# EAGLE schematic platiene1_v20 (EAGLE 9.7.0)
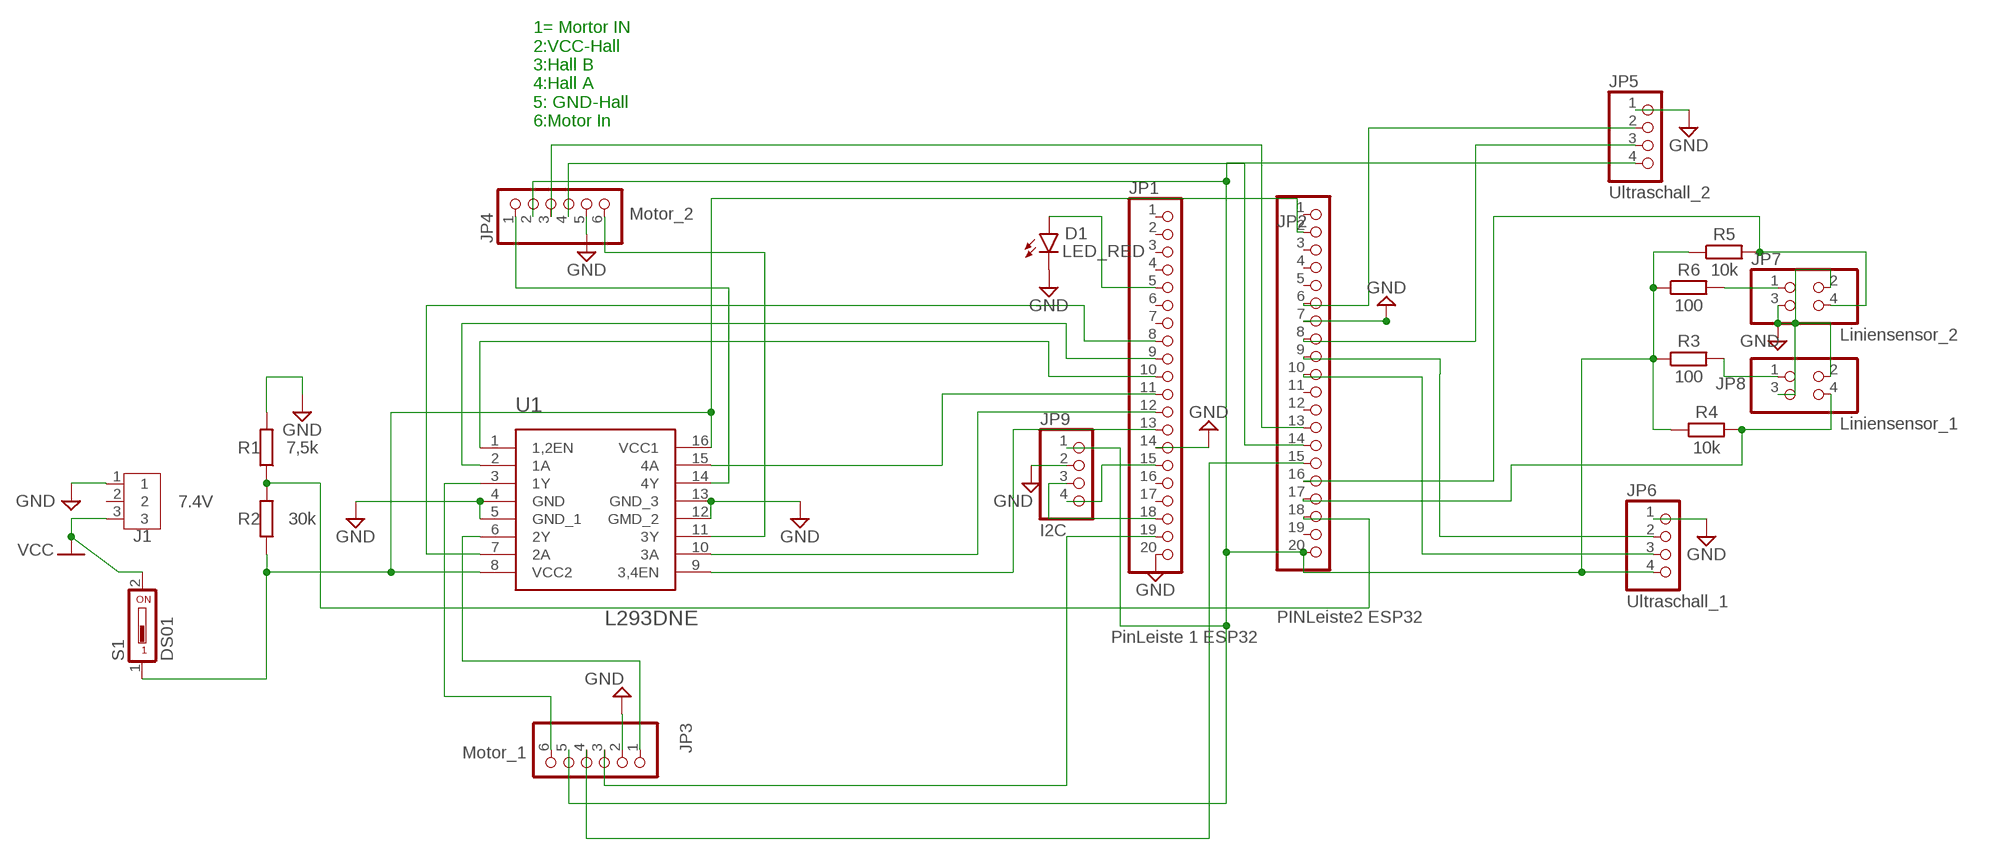
[diagram p0: schematic, sheet 1]

## Parts
D1  LED_RED  LED_RADIAL_RED  [LEDRD254W60D565H860B]
J1  7.4V  B3B-XH-A  [B3B-XH-A]
JP1  PinLeiste 1 ESP32  PINHD-1X20  [1X20]
JP2  PINLeiste2 ESP32  PINHD-1X20  [1X20]
JP3  Motor_1  PINHD-1X6  [1X06]
JP4  Motor_2  PINHD-1X6  [1X06]
JP5  Ultraschall_2  PINHD-1X4  [1X04]
JP6  Ultraschall_1  PINHD-1X4  [1X04]
JP7  Liniensensor_2  PINHD-2X2  [2X02]
JP8  Liniensensor_1  PINHD-2X2  [2X02]
JP9  I2C  PINHD-1X4  [1X04]
R1  7,5k  R_AXIAL-7.2MM-PITCH  [RESAD724W46L381D178B]
R2  30k  R_AXIAL-7.2MM-PITCH  [RESAD724W46L381D178B]
R3  100  R_AXIAL-7.2MM-PITCH  [RESAD724W46L381D178B]
R4  10k  R_AXIAL-7.2MM-PITCH  [RESAD724W46L381D178B]
R5  10k  R_AXIAL-7.2MM-PITCH  [RESAD724W46L381D178B]
R6  100  R_AXIAL-7.2MM-PITCH  [RESAD724W46L381D178B]
S1  DS01  [DS-01]
U1  L293DNE  [DIP-16_300MIL]

## Nets
GND: D1.2(C) J1.1 JP1.14 JP1.20 JP2.7 JP3.2 JP4.5 JP5.1 JP6.1 JP7.2 JP7.3 JP8.2 JP8.3 JP9.2 R1.2 U1.4(GND) U1.5(GND_1) U1.12(GMD_2) U1.13(GND_3)
N$1: JP1.11 U1.15(4A)
N$2: JP1.12 U1.10(3A)
N$3: JP1.13 U1.9(3,4EN)
N$4: JP1.10 U1.1(1,2EN)
N$5: JP1.8 U1.7(2A)
N$6: JP1.9 U1.2(1A)
N$7: JP2.2 R2.1 S1.1 U1.8(VCC2) U1.16(VCC1)
N$8: JP2.18 R1.1 R2.2
N$9: JP4.6 U1.11(3Y)
N$10: JP4.1 U1.14(4Y)
N$11: JP3.6 U1.3(1Y)
N$12: JP3.1 U1.6(2Y)
N$13: JP2.20 JP3.5 JP4.2 JP5.4 JP6.4 JP9.1 R3.1 R4.1 R5.1 R6.1
N$15: JP8.1 R3.2
N$16: JP2.6 JP5.2
N$17: JP7.1 R6.2
N$18: JP2.16 JP7.4 R5.2
N$19: JP2.17 JP8.4 R4.2
N$20: D1.1(A) JP1.5
N$21: JP2.8 JP5.3
N$22: JP2.9 JP6.2
N$23: JP2.13 JP4.3
N$24: JP2.10 JP6.3
N$27: JP2.14 JP4.4
N$28: JP2.15 JP3.4
N$29: JP1.19 JP3.3
N$30: JP1.18 JP9.3
N$31: JP1.15 JP9.4
VCC: J1.3 S1.2
Unconnected: J1.2 JP1.1 JP1.2 JP1.3 JP1.4 JP1.6 JP1.7 JP1.16 JP1.17 JP2.1 JP2.3 JP2.4 JP2.5 JP2.11 JP2.12 JP2.19

## Notes on the sheet
- 1= Mortor IN
  2:VCC-Hall
  3:Hall B
  4:Hall A
  5: GND-Hall
  6:Motor In

## Library data of the parts
D1 = Opto-Electronic:LED_RADIAL: LED - Generic; CATEGORY: Opto-Electronic; SUB-CATEGORY: LED
J1 = Connector:B3B-XH-A: XH Connector Top Entry - 3POS Details see: Datasheet <http://www.jst-mfg.com/product/pdf/eng/eXH.pdf>; CATEGORY: CONNECTOR; DESCRIPTION: 2.5mm pitch/disconnectable crimp style connector; MANUFACTURER: JST (XH connector); MPN: B3B-XH-A; PART_STATUS: ACTIVE; ROHS_COMPLIANT: COMPLIANT; SERIES: B3B-XH-A; SUB_CATEGORY: THROUGH HOLE CONNECTOR; TYPE: SIDE ENTRY; VALUE: 3A/250V
JP1 JP2 = Connector:PINHD-1X20: PIN HEADER; CATEGORY: CONNECTOR; SUB-CATEGORY: PIN-HEADER
JP3 JP4 = Connector:PINHD-1X6: PIN HEADER; CATEGORY: CONNECTOR; SUB-CATEGORY: PIN-HEADER
JP5 JP6 JP9 = Connector:PINHD-1X4: PIN HEADER; CATEGORY: CONNECTOR; SUB-CATEGORY: PIN-HEADER
JP7 JP8 = Connector:PINHD-2X2: PIN HEADER; CATEGORY: CONNECTOR; SUB-CATEGORY: PIN-HEADER
R1-R6 = Resistor:R: Resistor Fixed - Generic; CATEGORY: Resistor; SUB-CATEGORY: Fixed
S1 = Switch:DS01: DIL/CODE SWITCH; CATEGORY: SWITCH; TYPE: SPST
U1 = IC:L293DNE: IC MTR DRV BIPOLAR 4.5-36V 16DIP Manufacturer's datasheet <http://www.ti.com/general/docs/suppproductinfo.tsp?distId=10&gotoUrl=http%3A%2F%2Fwww.ti.com%2Flit%2Fgpn%2Fl293d>; CREATED_BY: PCBLayout.com; DIGI-KEY_PART: 296-9518-5-ND; MANUFACTURER: Texas Instruments; MPN: L293DNE; PACKAGE: DIP-16

## Module L293D
Ports: VCC(io) A(io)

### Library data of the parts